# Altium schematic sheet 主控.SchDoc
size A4
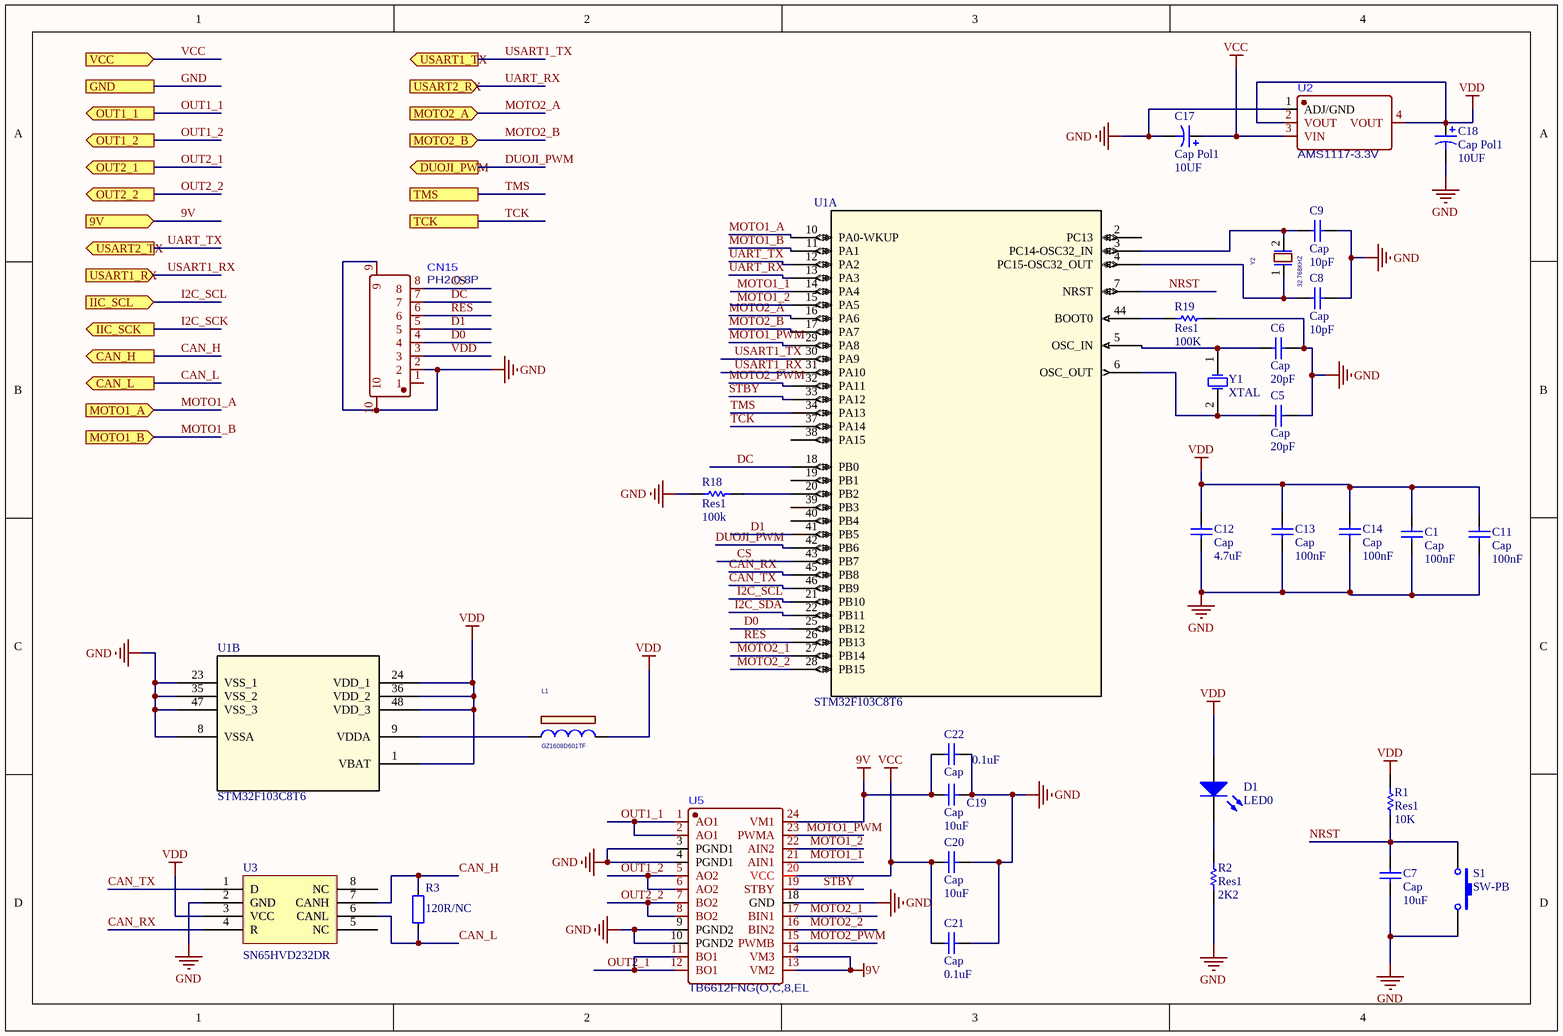
[diagram p0: 主控.SchDoc]

## Parts
C1  Cap  value 100nF  [R0603]
C5  Cap  value 20pF  [R0603]
C6  Cap  value 20pF  [R0603]
C7  Cap  value 10uF  [R0603]
C8  Cap  value 10pF  [R0603]
C9  Cap  value 10pF  [R0603]
C11  Cap  value 100nF  [R0603]
C12  Cap  value 4.7uF  [R0603]
C13  Cap  value 100nF  [R0603]
C14  Cap  value 100nF  [R0603]
C17  Cap Pol1  value 10UF  [CAP-SMD_L3.2-W1.6-RD]
C18  Cap Pol1  value 10UF  [CAP-SMD_L3.2-W1.6-RD]
C19  Cap  value 10uF  [CAP-SMD_L3.2-W2.8]
C20  Cap  value 10uF  [CAP-SMD_L3.2-W2.8]
C21  Cap  value 0.1uF  [R0603]
C22  Cap  value 0.1uF  [R0603]
CN15  PH2.0-8P  [CONN-SMD_X2016WRS-08-9TSW]
D1  LED0  [R0603]
L1  GZ1608D601TF  [L0603]
R1  Res1  value 10K  [R0603]
R2  Res1  value 2K2  [R0603]
R3  120R/NC  [R0603]
R18  Res1  value 100k  [R0603]
R19  Res1  value 100K  [R0603]
S1  SW-PB  [SW-SMD_L6.1-W3.6-LS7.1]
U1  STM32F103C8T6  [LQFP48-7x7mm]  (parts A,B of 2)
U2  AMS1117-3.3V  [SOT-223-4_L6.5-W3.5-P2.30-LS7.0-BR]
U3  Manufacturer Part Number: SN65HVD232DR  [SOIC-8_L5.0-W4.0-P1.27-LS6.0-BL]  (hidden comment: SN65HVD232D)
U5  TB6612FNG(O,C,8,EL  [SSOP-24_L8.4-W5.8-P0.65-LS7.8-BL]
Y1  XTAL  [OSC-SMD_L11.4-W4.5-LS12.5]
Y2  32.768KHZ  [3215]

## Ports
9V (in), CAN_H (out), CAN_L (out), DUOJI_PWM (out), GND, IIC_SCK (out), IIC_SCL (in), MOTO1_A (in), MOTO1_B (in), MOTO2_A (in), MOTO2_B (in), OUT1_1 (out), OUT1_2 (out), OUT2_1 (out), OUT2_2 (out), TCK, TMS, USART1_RX (in), USART1_TX (out), USART2_RX (in), USART2_TX (out), VCC (in)

## Nets
9V: C19.1 C22.1 U5.13(VM2) U5.14(VM3) U5.24(VM1) ; port 9V
GND: C1.1 C5.1 C6.1 C7.1 C8.1 C9.1 C11.1 C12.1 C13.1 C14.1 C17.2 C18.2 C19.2 C20.2 C21.2 C22.2 CN15.2 CN15.9 CN15.10 R2.2 R18.1 R19.2 S1.2 U1.8(VSSA) U1.23(VSS_1) U1.35(VSS_2) U1.47(VSS_3) U2.1(ADJ/GND) U3.2(GND) U5.3(PGND1) U5.4(PGND1) U5.9(PGND2) U5.10(PGND2) U5.18(GND) ; port GND
VCC: C17.1 C20.1 C21.1 U2.3(VIN) U5.20(VCC) ; port VCC
VDD: C1.2 C11.2 C12.2 C13.2 C14.2 C18.1 CN15.3 D1.1(A) L1.2 R1.2 U1.1(VBAT) U1.24(VDD_1) U1.36(VDD_2) U1.48(VDD_3) U2.2(VOUT) U2.4(VOUT) U3.3(VCC)
CAN_H: R3.1 U3.7(CANH) ; port CAN_H
CAN_L: R3.2 U3.6(CANL) ; port CAN_L
CAN_RX: U1.45(PB8) U3.4(R)
CAN_TX: U1.46(PB9) U3.1(D)
CS: CN15.8 U1.43(PB7)
D0: CN15.4 U1.25(PB12)
D1: CN15.5 U1.41(PB5)
DC: CN15.7 U1.18(PB0)
DUOJI_PWM: U1.42(PB6) ; port DUOJI_PWM
I2C_SCK: port IIC_SCK
I2C_SCL: U1.21(PB10) ; port IIC_SCL
I2C_SDA: U1.22(PB11)
MOTO1_1: U1.14(PA4) U5.21(AIN1)
MOTO1_2: U1.15(PA5) U5.22(AIN2)
MOTO1_A: U1.10(PA0-WKUP) ; port MOTO1_A
MOTO1_B: U1.11(PA1) ; port MOTO1_B
MOTO1_PWM: U1.29(PA8) U5.23(PWMA)
MOTO2_1: U1.27(PB14) U5.17(BIN1)
MOTO2_2: U1.28(PB15) U5.16(BIN2)
MOTO2_A: U1.16(PA6) ; port MOTO2_A
MOTO2_B: U1.17(PA7) ; port MOTO2_B
MOTO2_PWM: U1.32(PA11) U5.15(PWMB)
NRST: C7.2 R1.1 S1.1 U1.7(NRST)
OUT1_1: U5.1(AO1) U5.2(AO1) ; port OUT1_1
OUT1_2: U5.5(AO2) U5.6(AO2) ; port OUT1_2
OUT2_1: U5.11(BO1) U5.12(BO1) ; port OUT2_1
OUT2_2: U5.7(BO2) U5.8(BO2) ; port OUT2_2
RES: CN15.6 U1.26(PB13)
STBY: U1.33(PA12) U5.19(STBY)
TCK: U1.37(PA14) ; port TCK
TMS: U1.34(PA13) ; port TMS
UART_RX: U1.13(PA3) ; port USART2_RX
UART_TX: U1.12(PA2) ; port USART2_TX
USART1_RX: U1.31(PA10) ; port USART1_RX
USART1_TX: U1.30(PA9) ; port USART1_TX
NetC5_2: C5.2 U1.6(OSC_OUT) Y1.2(OSC2)
NetC6_2: C6.2 U1.5(OSC_IN) Y1.1(OSC1)
NetC8_2: C8.2 U1.4(PC15-OSC32_OUT) Y2.1
NetC9_2: C9.2 U1.3(PC14-OSC32_IN) Y2.2
NetD1_2: D1.2(K) R2.1
NetL1_1: L1.1 U1.9(VDDA)
NetR18_2: R18.2 U1.20(PB2)
NetR19_1: R19.1 U1.44(BOOT0)

Not connected (* = marked no-connect by the designer): CN15 1; U1 2(PC13) 19(PB1) 38(PA15) 39(PB3) 40(PB4); U3 5(NC) 8(NC)

## Library data of the parts
C1 C5-C9 C11-C14 C19-C22 = Cap: Capacitor; Published: 8-Jun-2000; LatestRevisionDate: 17-Jul-2002; LatestRevisionNote: Re-released for DXP Platform.; PackageReference: RAD-0.3; Publisher: Altium Limited; PackageDescription: Radial Cap, Thru-Hole; 2 Leads; 0.3 in Pin Spacing
C17 C18 = Cap Pol1: Polarized Capacitor (Radial); Published: 8-Jun-2000; LatestRevisionDate: 17-Jul-2002; LatestRevisionNote: Re-released for DXP Platform.; PackageReference: RB7.6-15; Publisher: Altium Limited; PackageDescription: Polarized Capacitor (Radial); 2 Leads
D1 = LED0: Typical INFRARED GaAs LED; Published: 8-Jun-2000; LatestRevisionDate: 08-Jul-2005; LatestRevisionNote: Mech Layer 1 removed.; PackageReference: LED-0; Publisher: Altium Limited; PackageDescription: LED; 2 Leads
L1 = INDUCTOR_FERRITE: IND FER BEAD 120 OHM@100MHZ 0.5A 25% 0402; PART_TYPE: FERRITE\BEAD; CLASS: DISCRETE; AGILE_PN: 180-77771; MFG_NAME01: Murata; MFG_PN01: BLM15AG121SN1D; CAD_APPROVED: Yes; FPLIST: IND_0402,0402_CC; Tolerance: 25%; ROHS: Yes; HEIGHT: 0.55MM
R1 R2 R18 R19 = Res1: Resistor; Published: 8-Jun-2000; LatestRevisionDate: 17-Jul-2002; LatestRevisionNote: Re-released for DXP Platform.; PackageReference: AXIAL-0.3; Publisher: Altium Limited; PackageDescription: Axial Device, Thru-Hole; 2 Leads; 0.3 in Pin Spacing
R3 = 电阻-0402: Resistor; Value: 22R
S1 = SW-PB: Switch; Published: 24-Mar-1999; LatestRevisionDate: 17-Jul-2002; LatestRevisionNote: Re-released for DXP Platform.; PackageReference: SPST-2; Publisher: Altium Limited; PackageDescription: Switch; 2 Leads
U1 = STM32F103C8T6: No Description Available; Vendor: STMicroelectronics; Built_By: EMA_UL_Team; SourceLibrary: Updates_to_database_2020-10-19; Manufacturer_Part_Number: STM32F103C8T6; Copyright: Copyright (C) 2018 Accelerated Designs. All rights reserved; RefDes: RefDes; Type: DEV
U3 = SN65HVD232D: Manufacturer: Texas Instruments; Protocol: CAN; Number of Drivers/Receivers: 1/1; Duplex: Half; Data Rate: 1Mbps; Voltage - Supply: 3 V ~ 3.6 V; Supplier 1: Digi-Key; Supplier Part Number 1: 296-26344-2-ND; RoHS: RoHS Compliant; Category: Integrated Circuits (ICs); Stock: 5000; Pricing 1: 2500=0.84375 (USD); Packaging: Tape & Reel (TR); Part Status: Active; Type: Transceiver; Operating Temperature: -40°C ~ 85°C; Mounting Type: Surface Mount; Package / Case: 8-SOIC (0.154", 3.90mm Width); Supplier Device Package: 8-SOIC; ComponentLink1URL: http://www.ti.com/lit/ds/symlink/sn65hvd230.pdf; ComponentLink1Description: http://www.ti.com/lit/ds/symlink/sn65hvd230.pdf; Supplier 2: Digi-Key; Supplier Part Number 2: 296-26344-1-ND; Pricing 2: 1=2.05, 10=1.842, 100=1.4809, 500=1.21668, 1000=1.00811 (USD)
Y1 = XTAL: Crystal Oscillator; Published: 8-Jun-2000; LatestRevisionDate: 17-Jul-2002; LatestRevisionNote: Re-released for DXP Platform.; PackageReference: R38; Publisher: Altium Limited; PackageDescription: Crystal, Thru-Hole; 2 Leads; Body 3.1 x 8.2 mm (Dia.xH)
Y2 = CRYSTAL: XTAL 32.768KHZ 7PF 20PPM -- SMT; CLASS: IC; CAD_APPROVED: Yes; MFG_PN01: FC-135 32.7680KA-AG3; MFG_NAME01: EPSON ELECTRONICS; AGILE_PN: 230-78102; HEIGHT: 0.9MM; ROHS: Yes